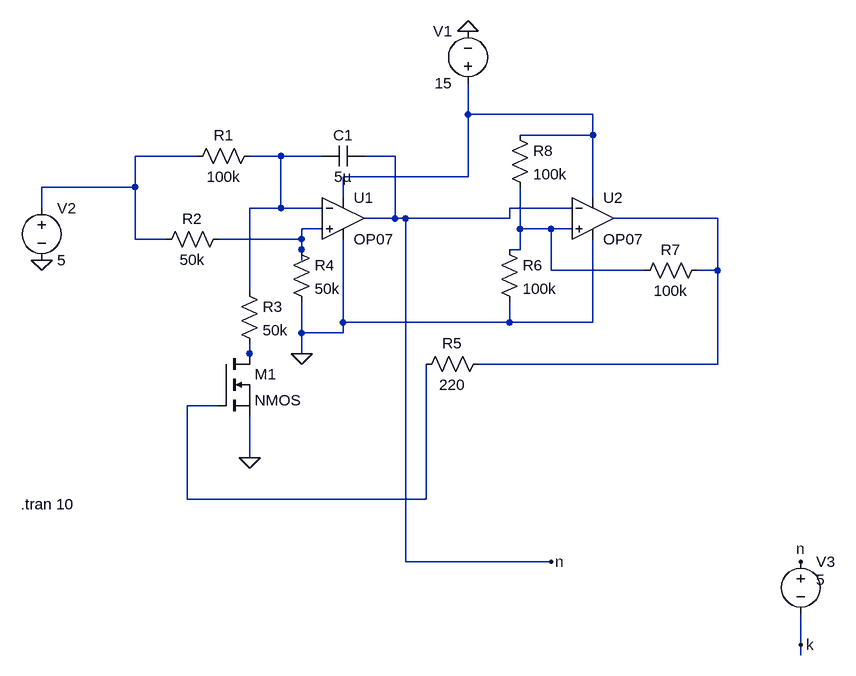
[diagram p0: schematic VCO_1_MOSFET.asc]
VCO_1_MOSFET.asc, the LTspice schematic file:
Version 4.1
SHEET 1 1780 884
WIRE 304 16 304 -32
WIRE 496 16 304 16
WIRE 496 48 496 16
WIRE 496 48 384 48
WIRE -112 80 -208 80
WIRE 16 80 -32 80
WIRE 80 80 16 80
WIRE 192 80 144 80
WIRE 304 112 304 16
WIRE 304 112 112 112
WIRE -208 128 -208 80
WIRE -208 128 -352 128
WIRE 112 144 112 112
WIRE 496 144 496 48
WIRE -352 160 -352 128
WIRE 16 160 16 80
WIRE 16 160 -32 160
WIRE 80 160 16 160
WIRE 464 160 368 160
WIRE 192 176 192 80
WIRE 192 176 144 176
WIRE 208 176 192 176
WIRE 368 176 368 160
WIRE 368 176 208 176
WIRE 688 176 528 176
WIRE 80 192 48 192
WIRE 384 192 384 128
WIRE 432 192 384 192
WIRE 464 192 432 192
WIRE -208 208 -208 128
WIRE -160 208 -208 208
WIRE 48 208 48 192
WIRE 48 208 -80 208
WIRE 48 224 48 208
WIRE 384 224 384 192
WIRE 384 224 368 224
WIRE 48 240 48 224
WIRE 432 256 432 192
WIRE 576 256 432 256
WIRE 688 256 688 176
WIRE 688 256 656 256
WIRE -32 288 -32 160
WIRE 112 336 112 208
WIRE 368 336 368 304
WIRE 368 336 112 336
WIRE 496 336 496 208
WIRE 496 336 368 336
WIRE 48 352 48 304
WIRE 112 352 112 336
WIRE 112 352 48 352
WIRE -32 384 -32 368
WIRE 48 384 48 352
WIRE -32 400 -32 384
WIRE 688 400 688 256
WIRE 688 400 320 400
WIRE -80 464 -128 464
WIRE -32 544 -32 480
WIRE -128 608 -128 464
WIRE 240 608 240 400
WIRE 240 608 -128 608
WIRE 208 704 208 176
WIRE 432 704 208 704
WIRE 816 832 816 784
WIRE 816 848 816 832
FLAG -32 544 0
FLAG 48 384 0
FLAG 304 -112 0
FLAG -352 240 0
FLAG 432 704 n
FLAG 816 704 n
FLAG 816 832 k
SYMBOL OpAmps\\OP07 112 112 R0
SYMATTR InstName U1
SYMBOL res -16 64 R90
WINDOW 0 0 56 VBottom 2
WINDOW 3 32 56 VTop 2
SYMATTR InstName R1
SYMATTR Value 100k
SYMBOL cap 144 64 R90
WINDOW 0 0 32 VBottom 2
WINDOW 3 32 32 VTop 2
SYMATTR InstName C1
SYMATTR Value 5µ
SYMBOL res -48 272 R0
SYMATTR InstName R3
SYMATTR Value 50k
SYMBOL res 336 384 R90
WINDOW 0 0 56 VBottom 2
WINDOW 3 32 56 VTop 2
SYMATTR InstName R5
SYMATTR Value 220
SYMBOL OpAmps\\OP07 496 112 R0
SYMATTR InstName U2
SYMBOL voltage 304 -16 R180
WINDOW 0 24 96 Left 2
WINDOW 3 24 16 Left 2
WINDOW 123 0 0 Left 0
WINDOW 39 0 0 Left 0
SYMATTR InstName V1
SYMATTR Value 15
SYMBOL res 352 208 R0
SYMATTR InstName R6
SYMATTR Value 100k
SYMBOL res 672 240 R90
WINDOW 0 0 56 VBottom 2
WINDOW 3 32 56 VTop 2
SYMATTR InstName R7
SYMATTR Value 100k
SYMBOL res 368 32 R0
SYMATTR InstName R8
SYMATTR Value 100k
SYMBOL voltage -352 144 R0
WINDOW 123 0 0 Left 0
WINDOW 39 0 0 Left 0
SYMATTR InstName V2
SYMATTR Value 5
SYMBOL nmos -80 384 R0
SYMATTR InstName M1
SYMBOL res -64 192 R90
WINDOW 0 0 56 VBottom 2
WINDOW 3 32 56 VTop 2
SYMATTR InstName R2
SYMATTR Value 50k
SYMBOL res 32 208 R0
SYMATTR InstName R4
SYMATTR Value 50k
SYMBOL voltage 816 688 R0
WINDOW 3 24 44 Left 2
WINDOW 123 0 0 Left 0
WINDOW 39 0 0 Left 0
SYMATTR InstName V3
SYMATTR Value 5
TEXT -384 616 Left 2 !.tran 10

The netlist it stands for:
* VCO_1_MOSFET.asc
X§U1 N005 N003 N001 0 n LT1001  ; OP07, pins In+ In- V+ V- OUT
R1 N003 N002 100k
C1 n N003 5µ
R3 N003 N007 50k
R5 N004 N008 220
X§U2 N006 n N001 0 N004 LT1001  ; OP07, pins In+ In- V+ V- OUT
V1 N001 0 15
R6 N006 0 100k
R7 N004 N006 100k
R8 N001 N006 100k
V2 N002 0 5
M1 N007 N008 0 0 NMOS
R2 N005 N002 50k
R4 N005 0 50k
V3 n k 5
.model NMOS NMOS
.model PMOS PMOS
.lib standard.mos
.tran 10
.lib LTC.lib
.backanno
.end